# Altium project MOTOR_DRIVE_EVAL.PrjPCB (part 2 of 2)

## Sheet 12-TEMPERATURE.SchDoc: TEMPERATURE
size A4; Author: Alexandre Cosneau; CompanyName: Tristar Multicopters; DrawnBy: Alexandre Cosneau; Engineer: Alexandre Cosneau; Organization: Tristar Multicopters; Address1: Genie / GEGI; Address2: 2500 boulevard de l'universite; Address3: J1K2R SHERBROOKE; Address4: QUEBEC, CANADA; DocumentNumber: 5; Revision: 1.0; SheetNumber: 5; SheetTotal: 7
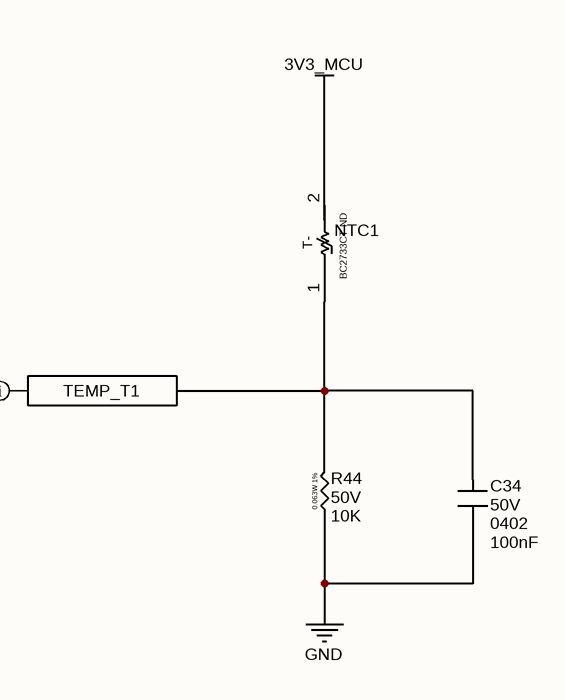
[diagram p14: 12-TEMPERATURE.SchDoc]

### Parts
C34  VDC: 50V  Package: 0402  [C 0402(1005)x0.5]  (hidden comment: 100nF)
NTC1  Supplier Part Number 1: BC2733CT-ND  [R 0805(2012)]  (hidden comment: NTCS0805E3103FLT)
R44  VDC: 50V  [R 0402(1005)-1%]  (hidden comment: 10K)

### Ports
TEMP_T1

### Nets
3V3_MCU: NTC1.2
GND: C34.2 R44.1
NetC34_1: C34.1 NTC1.1 R44.2 ; port TEMP_T1

### Layout directives
net class ANALOG: NetC34_1

### Notes on the sheet
- Title:
- Size:
- Date:
- A
- Revision:
- Time:
- Author:
- Sheet
- of
- File:
- (in symbol NTCS0805E3103FLT) T-
- (in symbol RES 0402-1%) 0.063W 1%

### Library data of the parts
C34 = CAP 0402 100nF 50V X7R: SMD-0402 100nF 50V X7R 10%; Part Number: CL05B104KB5NNNC; Manufacturer: Samsung; TYPE: Capacitors; Package-mm: 1005; Mount Type: SMT; Publisher: Hefest; Manufacturer Alternate: *; Part Number Alternate: *; Published: 07.04.2019; Supplier 1: Comet; Supplier 2: *; Supplier 3: *; Supplier Part Number 1: C0402 100nF 50V X7R; Supplier Part Number 2: *; Supplier Part Number 3: *; RoHS: Y; Technology: Ceramic  MLCC; Value 1: *; Value 2: *; TempCo: X7R; Tolerance %: ±10%; VAC: *; ESR Ohm: *; ComponentLink1Description: Datasheet link; ComponentLink1URL: https://store.comet.bg/download-file.php?id=11; Temperature Range: -55°C ~ +125°C; Price: 0.039; Value: 100nF
NTC1 = NTCS0805E3103FLT: THERMISTOR NTC 10KOHM 3430K 0805; Supplier 1: Digi-Key
R44 = RES 0402-1%: SMD 0402 0.063W 1% 50V; Manufacturer: YAGEO; TempCo: ±100ppm/°C; Package-mm: 1005; Value Code: 1001; Power: 0.0625W; Part Number: *; Mount Type: SMT; Publisher: Hefest; Manufacturer Alternate: *; Published: 07.04.2019; Supplier 1: Comet; Supplier 2: *; Supplier 3: *; Supplier Part Number 1: R0402 1.0K 1% YAG/ASJ; Supplier Part Number 2: *; Supplier Part Number 3: *; RoHS: Y; Technology: Thick film; Value 2: *; Package: 0402; Tolerance %: ±1%; ComponentLink1Description: Datasheet link; ComponentLink1URL: https://store.comet.bg/download-file.php?id=1224; Temperature Range: -55°C ~ +155°C; Price: 0.015; Part Number Alternate: *; TYPE: Resistor; Value 1: *; Value: 10K

## Sheet 13-MECHANICALS.SchDoc: MECHANICALS
size A4; Author: Alexandre Cosneau; CompanyName: Tristar Multicopters; DrawnBy: Alexandre Cosneau; Engineer: Alexandre Cosneau; Organization: Tristar Multicopters; Address1: Genie / GEGI; Address2: 2500 boulevard de l'universite; Address3: J1K2R SHERBROOKE; Address4: QUEBEC, CANADA; DocumentNumber: 7; Revision: 1.0; SheetNumber: 7; SheetTotal: 7
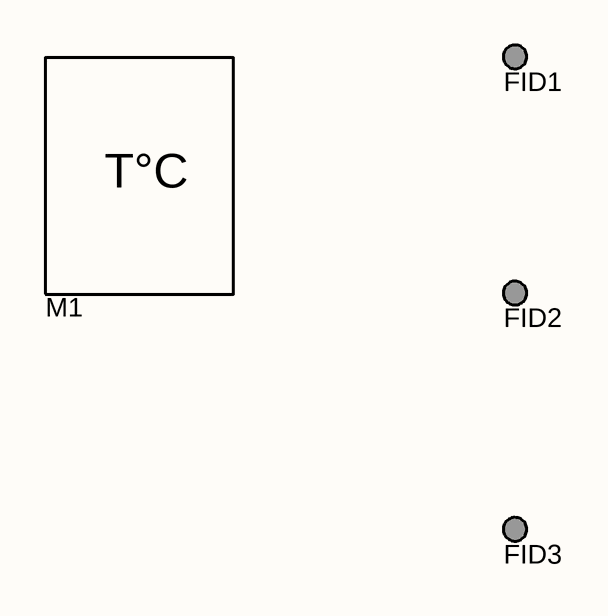
[diagram p15: 13-MECHANICALS.SchDoc]

### Parts
FID1  Fiducial  [FID_05MM]  (value not drawn)  (net tie, no BOM)
FID2  Fiducial  [FID_05MM]  (value not drawn)  (net tie, no BOM)
FID3  Fiducial  [FID_05MM]  (value not drawn)  (net tie, no BOM)
M1  THERMAL PAD  (value not drawn)  (net tie, no BOM)

### Notes on the sheet
- Title:
- Size:
- Date:
- A
- Revision:
- Time:
- Author:
- Sheet
- of
- File:
- (in symbol THERMAL PAD) T°C

### Library data of the parts
FID1-FID3 = FID_05MM: FIDUCIAL 05 MM; Value: Top; Package: Fiducial; Published: 07.04.2019; Mount Type: SMT; Publisher: Hefest; Technology: Pcb; TYPE: Fiducial
M1 = THERMAL PAD: THERMAL PAD NEEDED

## Nets that join several sheets
3V3: 2-BUCK_3V3_MCU (5 pins), 3-MCU (22 pins), 4-JTAG (J4.1 R17#1.2 R19#1.2 R20#1.2), 5-CAN_TRANSCEIVER (C25#1.1 C26.1 TVS1.3 U7.3), 7-PWM_INTERLOCK (6 pins)
3V3_MCU: 11-HALF_BRIDGE (D2#2.1), 12-TEMPERATURE (NTC1.2)
6V_DRV: 8-DRV_LDO_6V (5 pins), 11-HALF_BRIDGE (C11#2.1 C12#2.1 U2#2.A3 U2#2.C4)
7-8V: 2-BUCK_3V3_MCU (C1#1.1 C2#1.1 U1#1.3 U1#1.4), 3-MCU (C16#1.1 U6.2), 8-DRV_LDO_6V (C1#2.1 R1#2.2 U1#2.6)
A3V3: 3-MCU (5 pins), 9-SIGNAL_CONDITIONING (C23#2.1)
AGND: 3-MCU (11 pins), 9-SIGNAL_CONDITIONING (C23#2.2)
GND: 2-BUCK_3V3_MCU (8 pins), 3-MCU (32 pins), 4-JTAG (J4.3 J4.5 J4.9 R18#1.1), 5-CAN_TRANSCEIVER (7 pins), 7-PWM_INTERLOCK (7 pins), 8-DRV_LDO_6V (8 pins), 10-BUS_SENS (C35.2 R46.1 R48.1), 11-HALF_BRIDGE (12 pins), 12-TEMPERATURE (C34.2 R44.1)
V_BUS: 10-BUS_SENS (R47.2), 11-HALF_BRIDGE (C17#2.1 C18#2.1 Q1#2.D)
RST: 3-MCU (5 pins), 4-JTAG (J4.10)
TIM2_CH1: 3-MCU (U2#1.C6), 11-HALF_BRIDGE (D3#2.1)

## Assembly variants
PRODUCTION: not fitted C? D? J? R? R?